# EasyEDA schematic ESP32_RelayControl.json
TITLE: ESP32 Relay Control; REV: 1.0; Date: 2024-05-09; Sheet: 1/1; Company: NS
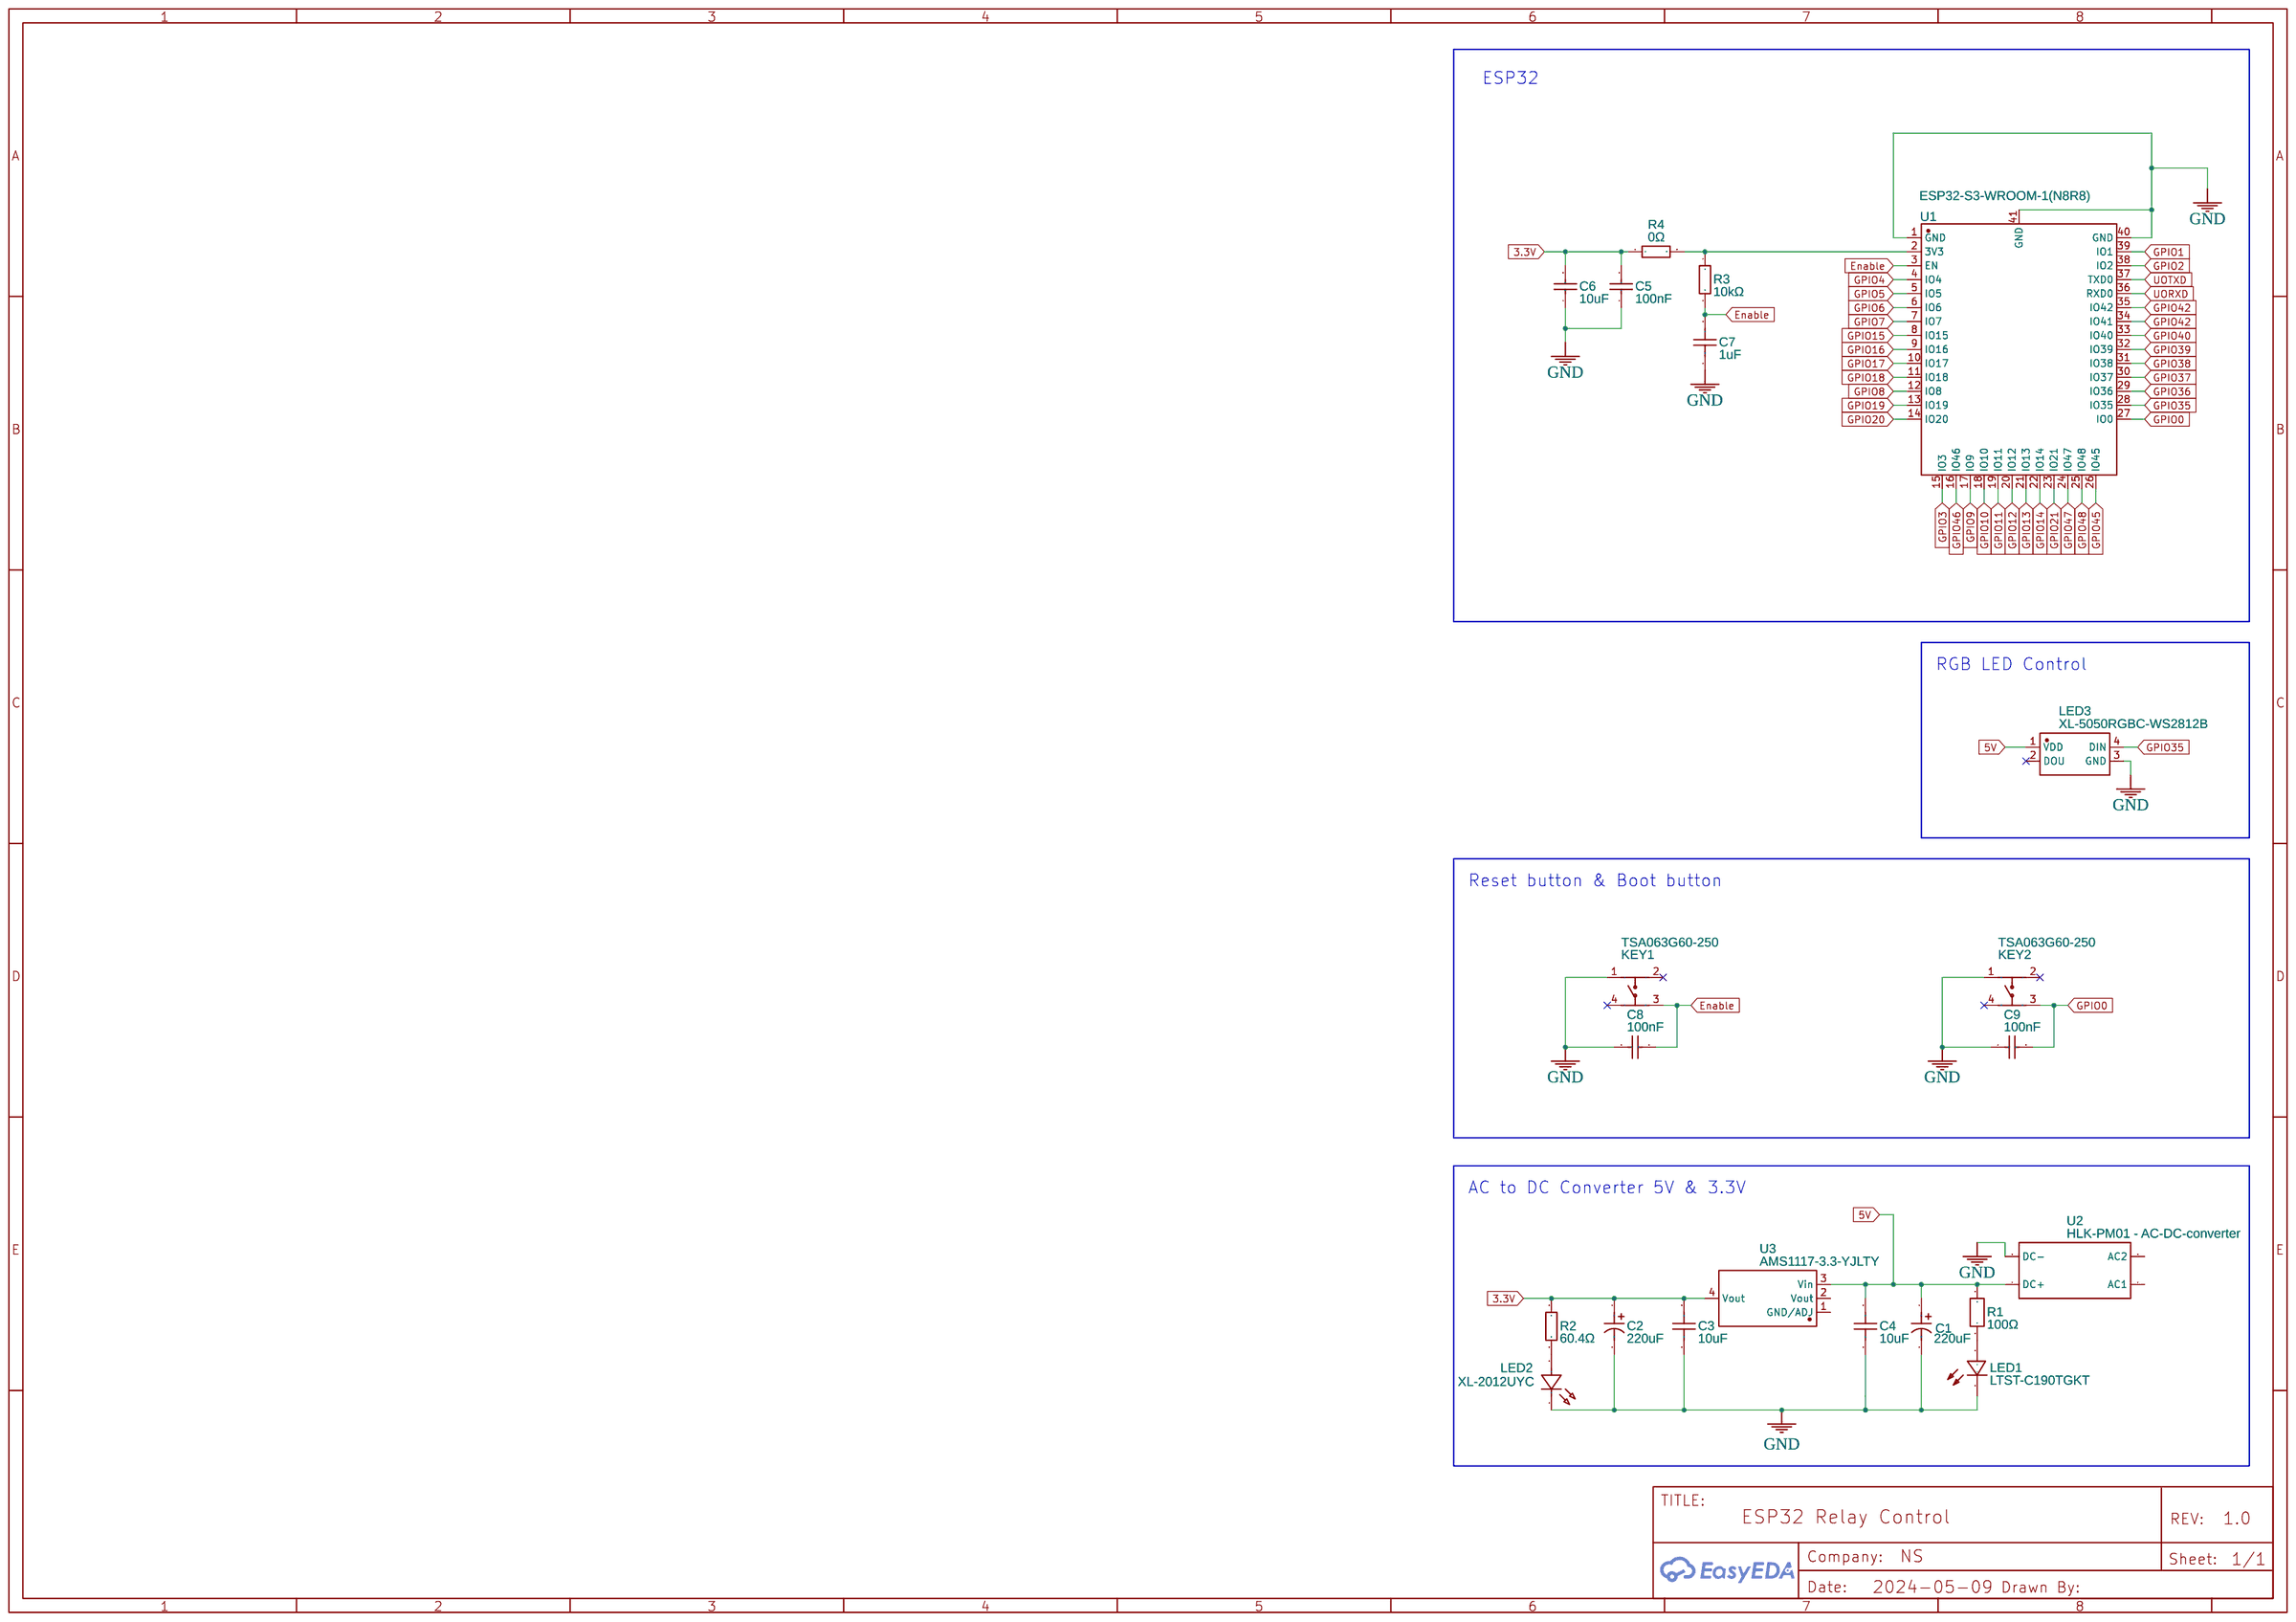
[diagram p0: schematic sheet]

## Parts
C1  220uF  [CAP-SMD_BD6.3-L6.6-W6.6-LS7.2-FD]
C2  220uF  [CAP-SMD_BD6.3-L6.6-W6.6-LS7.2-FD]
C3  10uF  [C0805]
C4  10uF  [C0805]
C5  100nF  [C0805]
C6  10uF  [C0805]
C7  1uF  [C0805]
C8  100nF  [C0805]
C9  100nF  [C0805]
KEY1  TSA063G60-250  [KEY-SMD_4P-L6.1-W6.1-P4.50-LS9.0]
KEY2  TSA063G60-250  [KEY-SMD_4P-L6.1-W6.1-P4.50-LS9.0]
LED1  LTST-C190TGKT  [LED0603-RD]
LED2  XL-2012UYC  [LED0805-RD_YELLOW]
LED3  XL-5050RGBC-WS2812B  [LED-SMD_4P-L5.0-W5.0-BL_XL-5050RGBC]
R1  100Ω  [R0805]
R2  60.4Ω  [R0805]
R3  10kΩ  [R0805]
R4  0Ω  [R0805]
U1  ESP32-S3-WROOM-1(N8R8)  [WIRELM-SMD_ESP32-S3-WROOM-1]
U2  HLK-PM01 - AC-DC-converter  [HLK-PM01 3W]
U3  AMS1117-3.3-YJLTY  [SOT-223-3_L6.5-W3.4-P2.30-LS7.0-BR]

## Library data of the parts
C1 C2 = MVG 16V 220UF 6.3*7.7: Contributor: LCSC; Supplier: LCSC; Supplier Part: C2827940; Manufacturer: SAMYOUNG(韩国三莹); JLCPCB Part Class: Extended Part
C3 C4 = 0805F106M160NT: Supplier: LCSC; Manufacturer: FH(风华); Supplier Part: C90545; JLCPCB Part Class: Extended Part
C5 C8 C9 = 0805B104K500NT: Supplier: LCSC; Manufacturer: FH(风华); Supplier Part: C38141; JLCPCB Part Class: Extended Part
C6 = 0805X106K250NT: Supplier: LCSC; Manufacturer: FH(风华); Supplier Part: C40894; JLCPCB Part Class: Extended Part
C7 = 0805B105K160NT: Supplier: LCSC; Manufacturer: FH(风华); Supplier Part: C89259; JLCPCB Part Class: Extended Part
KEY1 KEY2 = TSA063G60-250: Contributor: LCSC; Supplier: LCSC; Supplier Part: C294566; Manufacturer: BRIGHT(博瑞泰); JLCPCB Part Class: Extended Part
LED1 = LTST-C190TGKT: Contributor: LCSC; Supplier: LCSC; Supplier Part: C364559; Manufacturer: LITEON(光宝); JLCPCB Part Class: Extended Part
LED2 = XL-2012UYC: Contributor: LCSC; Supplier: LCSC; Supplier Part: C965814; Manufacturer: XINGLIGHT(成兴光); JLCPCB Part Class: Extended Part
LED3 = XL-5050RGBC-WS2812B: Contributor: LCSC; Supplier: LCSC; Supplier Part: C2843785; Manufacturer: XINGLIGHT(成兴光); JLCPCB Part Class: Extended Part
R1 = CRCW0805100RFKEA: Contributor: LCSC; Supplier: LCSC; Supplier Part: C844936; Manufacturer: VISHAY(威世); JLCPCB Part Class: Extended Part
R2 = RC0805FR-0760R4L: Contributor: LCSC; Supplier: LCSC; Supplier Part: C273897; Manufacturer: YAGEO(国巨); JLCPCB Part Class: Extended Part
R3 = AF0805JR-0710KL: Supplier: LCSC; Manufacturer: YAGEO(国巨); Supplier Part: C144127; JLCPCB Part Class: Extended Part
R4 = 0805W8F0000T5E: Supplier: LCSC; Manufacturer: UNI-ROYAL(厚声); Supplier Part: C17477; JLCPCB Part Class: Basic Part
U1 = ESP32-S3-WROOM-1(N8R8): Contributor: LCSC; Supplier: LCSC; Supplier Part: C2913201; Manufacturer: ESPRESSIF(乐鑫); Manufacturer Part: ESP32-S3-WROOM-1-N8R8; JLCPCB Part Class: Extended Part
U2 = HLK-PM01 - AC-DC-converter: Manufacturer: HI-LINK(海凌科); Manufacturer Part: HLK-PM01; Supplier: LCSC; Supplier Part: C209903; Contributor: aleortiz
U3 = AMS1117-3.3-YJLTY: Contributor: LCSC; Supplier: LCSC; Supplier Part: C9900003397; Manufacturer: null; JLCPCB Part Class: Extended Part

## Nets
3.3V: C2.1 C3.2 C5.2 C6.2 R2.2 R4.1 U3.4(Vout)
5V: C1.1 C4.2 LED3.1(VDD) R1.2 U2.4(DC+) U3.3(Vin)
GND: C1.2 C2.2 C3.1 C4.1 C5.1 C6.1 C7.1 C8.1 C9.1 KEY1.1 KEY2.1 LED1.1(-) LED2.1(K) LED3.3(GND) U1.1(GND) U1.40(GND) U1.41(GND) U2.3(DC-)
Enable: C7.2 C8.2 KEY1.3 R3.2 U1.3(EN)
GPIO0: C9.2 KEY2.3 U1.27(IO0)
GPIO1: U1.39(IO1)
GPIO2: U1.38(IO2)
GPIO3: U1.15(IO3)
GPIO4: U1.4(IO4)
GPIO5: U1.5(IO5)
GPIO6: U1.6(IO6)
GPIO7: U1.7(IO7)
GPIO8: U1.12(IO8)
GPIO9: U1.17(IO9)
GPIO10: U1.18(IO10)
GPIO11: U1.19(IO11)
GPIO12: U1.20(IO12)
GPIO13: U1.21(IO13)
GPIO14: U1.22(IO14)
GPIO15: U1.8(IO15)
GPIO16: U1.9(IO16)
GPIO17: U1.10(IO17)
GPIO18: U1.11(IO18)
GPIO19: U1.13(IO19)
GPIO20: U1.14(IO20)
GPIO21: U1.23(IO21)
GPIO35: LED3.4(DIN) U1.28(IO35)
GPIO36: U1.29(IO36)
GPIO37: U1.30(IO37)
GPIO38: U1.31(IO38)
GPIO39: U1.32(IO39)
GPIO40: U1.33(IO40)
GPIO42: U1.34(IO41) U1.35(IO42)
GPIO45: U1.26(IO45)
GPIO46: U1.16(IO46)
GPIO47: U1.24(IO47)
GPIO48: U1.25(IO48)
UORXD: U1.36(RXD0)
UOTXD: U1.37(TXD0)
Net-(LED1-2): LED1.2(+) R1.1
Net-(LED2-2): LED2.2(A) R2.1
Net-(R3-1): R3.1 R4.2 U1.2(3V3)

Not connected (* = marked no-connect by the designer): KEY1 2* 4*; KEY2 2* 4*; LED3 2(DOU)*; U2 1(AC1) 2(AC2); U3 1(GND/ADJ) 2(Vout)

## Notes on the sheet
- ESP32
- RGB LED Control
- Reset button & Boot button
- AC to DC Converter 5V & 3.3V
